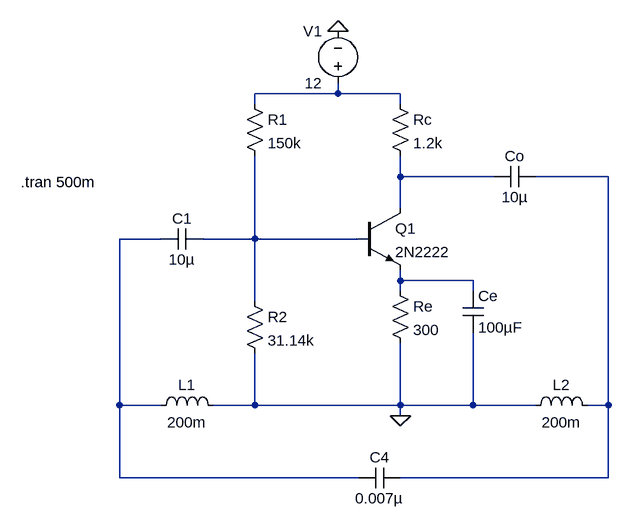
[diagram p0: schematic Hartley_Oscillator_Transistor.asc]
Hartley_Oscillator_Transistor.asc, the LTspice schematic file:
Version 4
SHEET 1 880 680
WIRE 144 -48 144 -64
WIRE 144 -48 16 -48
WIRE 240 -48 144 -48
WIRE 16 -32 16 -48
WIRE 240 -32 240 -48
WIRE 240 80 240 48
WIRE 384 80 240 80
WIRE 560 80 448 80
WIRE 240 128 240 80
WIRE -128 176 -192 176
WIRE 16 176 16 48
WIRE 16 176 -64 176
WIRE 176 176 16 176
WIRE 240 240 240 224
WIRE 352 240 240 240
WIRE 240 256 240 240
WIRE 352 256 352 240
WIRE 16 272 16 176
WIRE -192 432 -192 176
WIRE -128 432 -192 432
WIRE 16 432 16 352
WIRE 16 432 -48 432
WIRE 240 432 240 336
WIRE 240 432 16 432
WIRE 352 432 352 320
WIRE 352 432 240 432
WIRE 448 432 352 432
WIRE 560 432 560 80
WIRE 560 432 528 432
WIRE 240 448 240 432
WIRE -192 544 -192 432
WIRE 176 544 -192 544
WIRE 560 544 560 432
WIRE 560 544 240 544
FLAG 144 -144 0
FLAG 240 448 0
SYMBOL npn 176 128 R0
SYMATTR InstName Q1
SYMATTR Value 2N2222
SYMBOL res 224 -48 R0
SYMATTR InstName Rc
SYMATTR Value 1.2k
SYMBOL res 0 -48 R0
SYMATTR InstName R1
SYMATTR Value 150k
SYMBOL res 0 256 R0
SYMATTR InstName R2
SYMATTR Value 31.14k
SYMBOL res 224 240 R0
SYMATTR InstName Re
SYMATTR Value 300
SYMBOL ind -144 448 R270
WINDOW 0 32 56 VTop 2
WINDOW 3 5 56 VBottom 2
SYMATTR InstName L1
SYMATTR Value 200m
SYMBOL ind 432 448 R270
WINDOW 0 32 56 VTop 2
WINDOW 3 5 56 VBottom 2
SYMATTR InstName L2
SYMATTR Value 200m
SYMBOL cap 336 256 R0
SYMATTR InstName Ce
SYMATTR Value 100µF
SYMBOL cap 448 64 R90
WINDOW 0 0 32 VBottom 2
WINDOW 3 32 32 VTop 2
SYMATTR InstName Co
SYMATTR Value 10µ
SYMBOL cap -64 160 R90
WINDOW 0 0 32 VBottom 2
WINDOW 3 32 32 VTop 2
SYMATTR InstName C1
SYMATTR Value 10µ
SYMBOL cap 240 528 R90
WINDOW 0 0 32 VBottom 2
WINDOW 3 32 32 VTop 2
SYMATTR InstName C4
SYMATTR Value 0.007µ
SYMBOL voltage 144 -48 R180
WINDOW 0 24 96 Left 2
WINDOW 3 24 16 Left 2
SYMATTR InstName V1
SYMATTR Value 12
TEXT -344 88 Left 2 !.tran 500m

The netlist it stands for:
* Hartley_Oscillator_Transistor.asc
Q1 N002 N005 N006 0 2N2222
Rc N001 N002 1.2k
R1 N001 N005 150k
R2 N005 0 31.14k
Re N006 0 300
L1 N004 0 200m
L2 0 N003 200m
Ce N006 0 100µF
Co N003 N002 10µ
C1 N005 N004 10µ
C4 N003 N004 0.007µ
V1 N001 0 12
.model NPN NPN
.model PNP PNP
.lib standard.bjt
.tran 500m
.backanno
.end